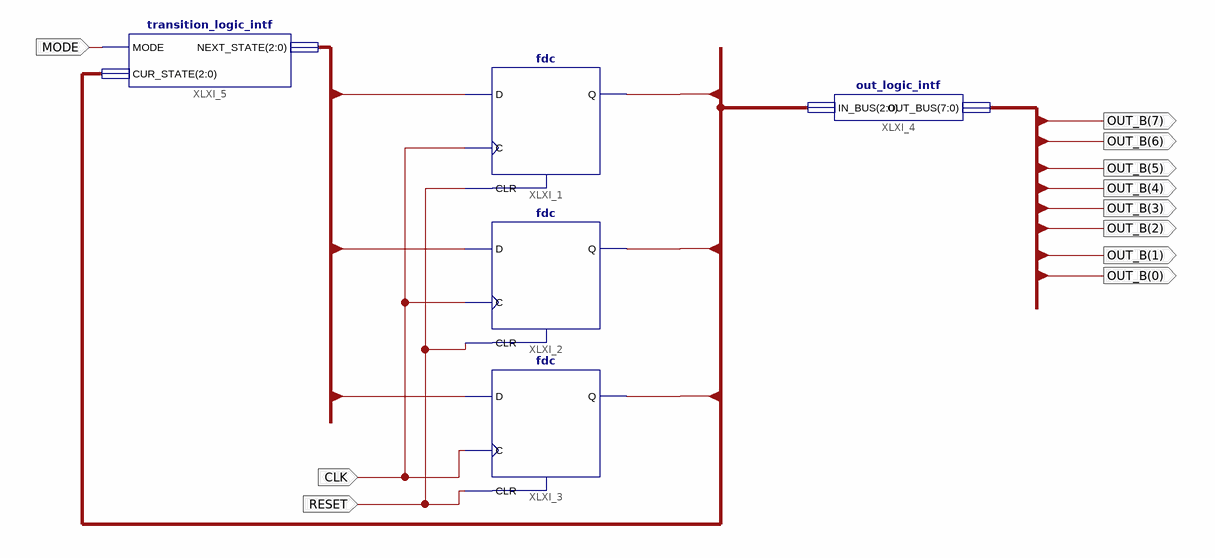
[diagram p0: schematic sheet 1]
// Xilinx ISE schematic LightControler.sch (spartan3a) as structural Verilog: 5 symbols, 11 ports
module LightControler (
  input  CLK,
  input  RESET,
  input  MODE,
  output [7:0] OUT_B
);

  wire [2:0] CUR_STATE_BUS, NS_BUS;

  fdc XLXI_1 (.C(CLK), .CLR(RESET), .D(NS_BUS[2]), .Q(CUR_STATE_BUS[2]));
  fdc XLXI_2 (.C(CLK), .CLR(RESET), .D(NS_BUS[1]), .Q(CUR_STATE_BUS[1]));
  fdc XLXI_3 (.C(CLK), .CLR(RESET), .D(NS_BUS[0]), .Q(CUR_STATE_BUS[0]));
  out_logic_intf XLXI_4 (.IN_BUS(CUR_STATE_BUS), .OUT_BUS(OUT_B));
  transition_logic_intf XLXI_5 (.MODE(MODE), .CUR_STATE(CUR_STATE_BUS), .NEXT_STATE(NS_BUS));
endmodule
